# EAGLE board LEDCube_Par (EAGLE 5.09)
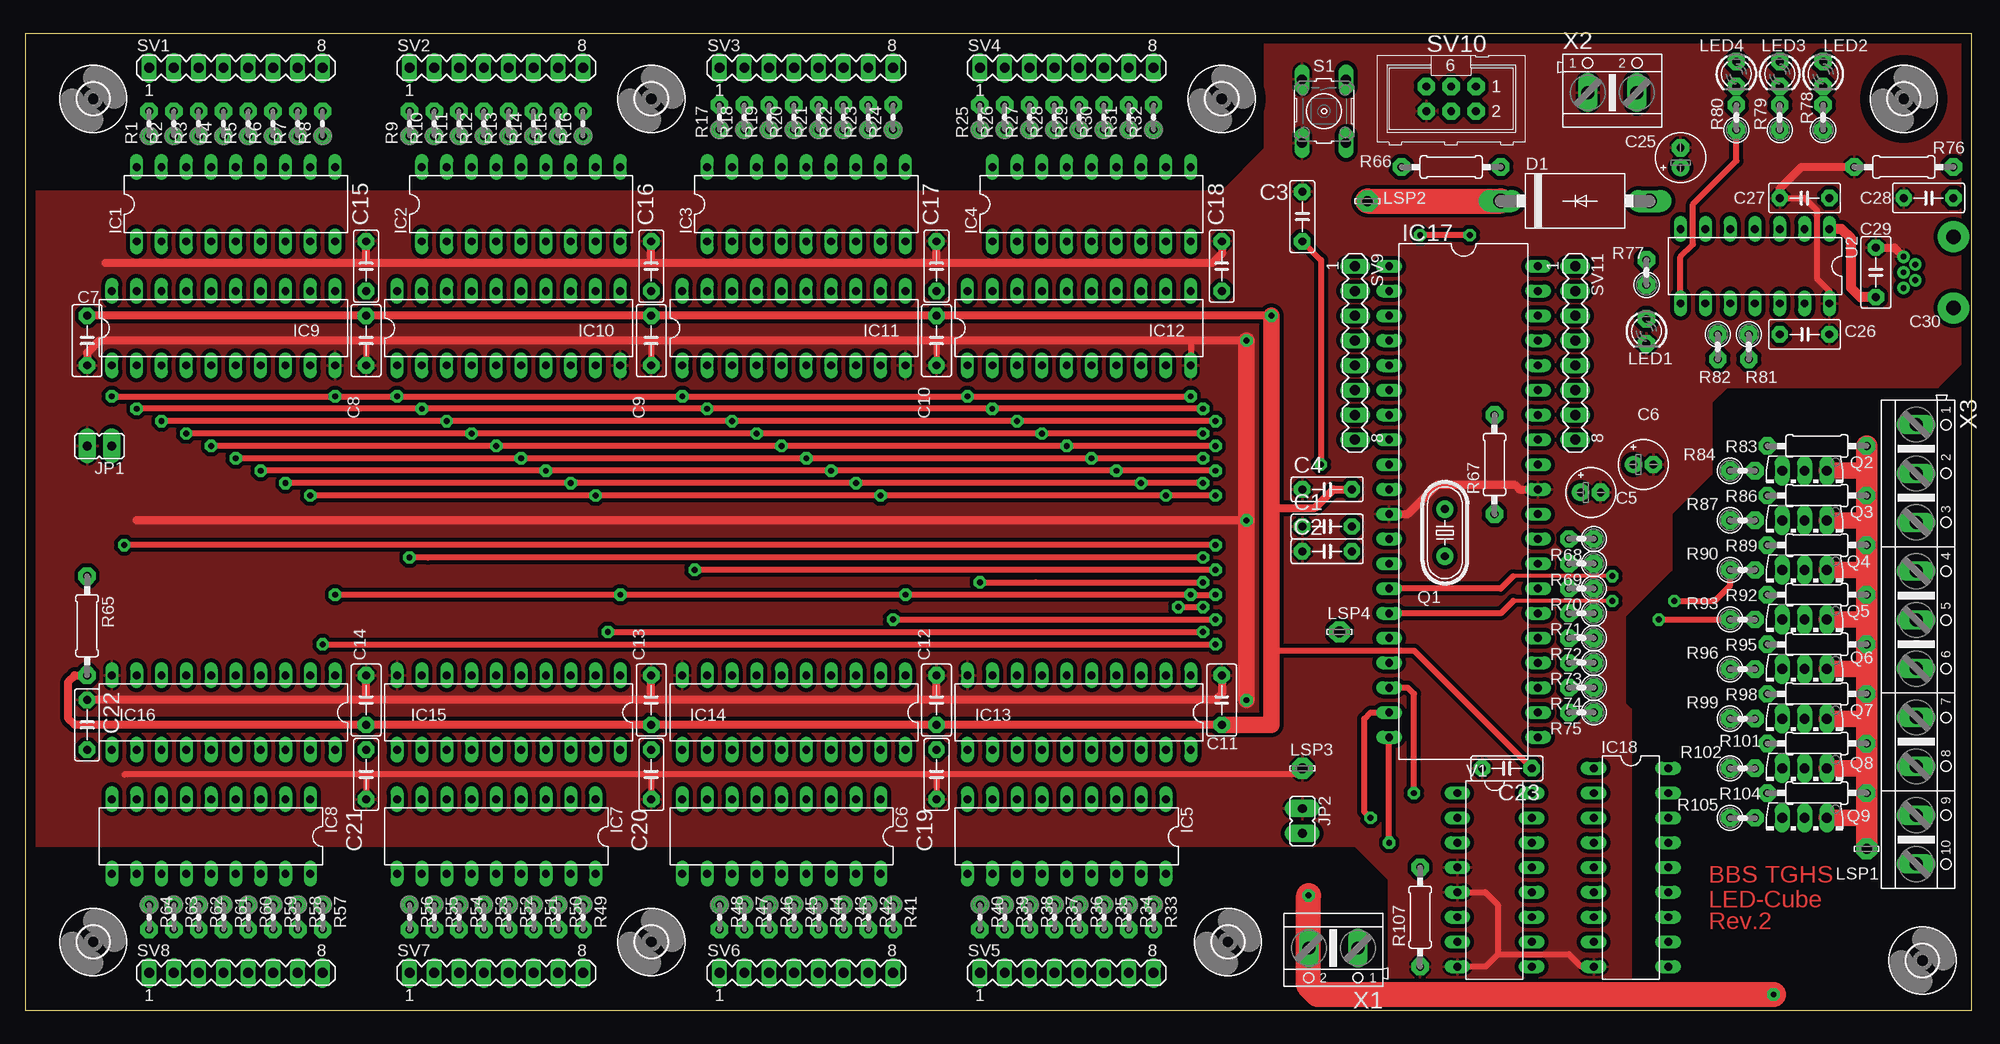
[diagram p1: board, top side]
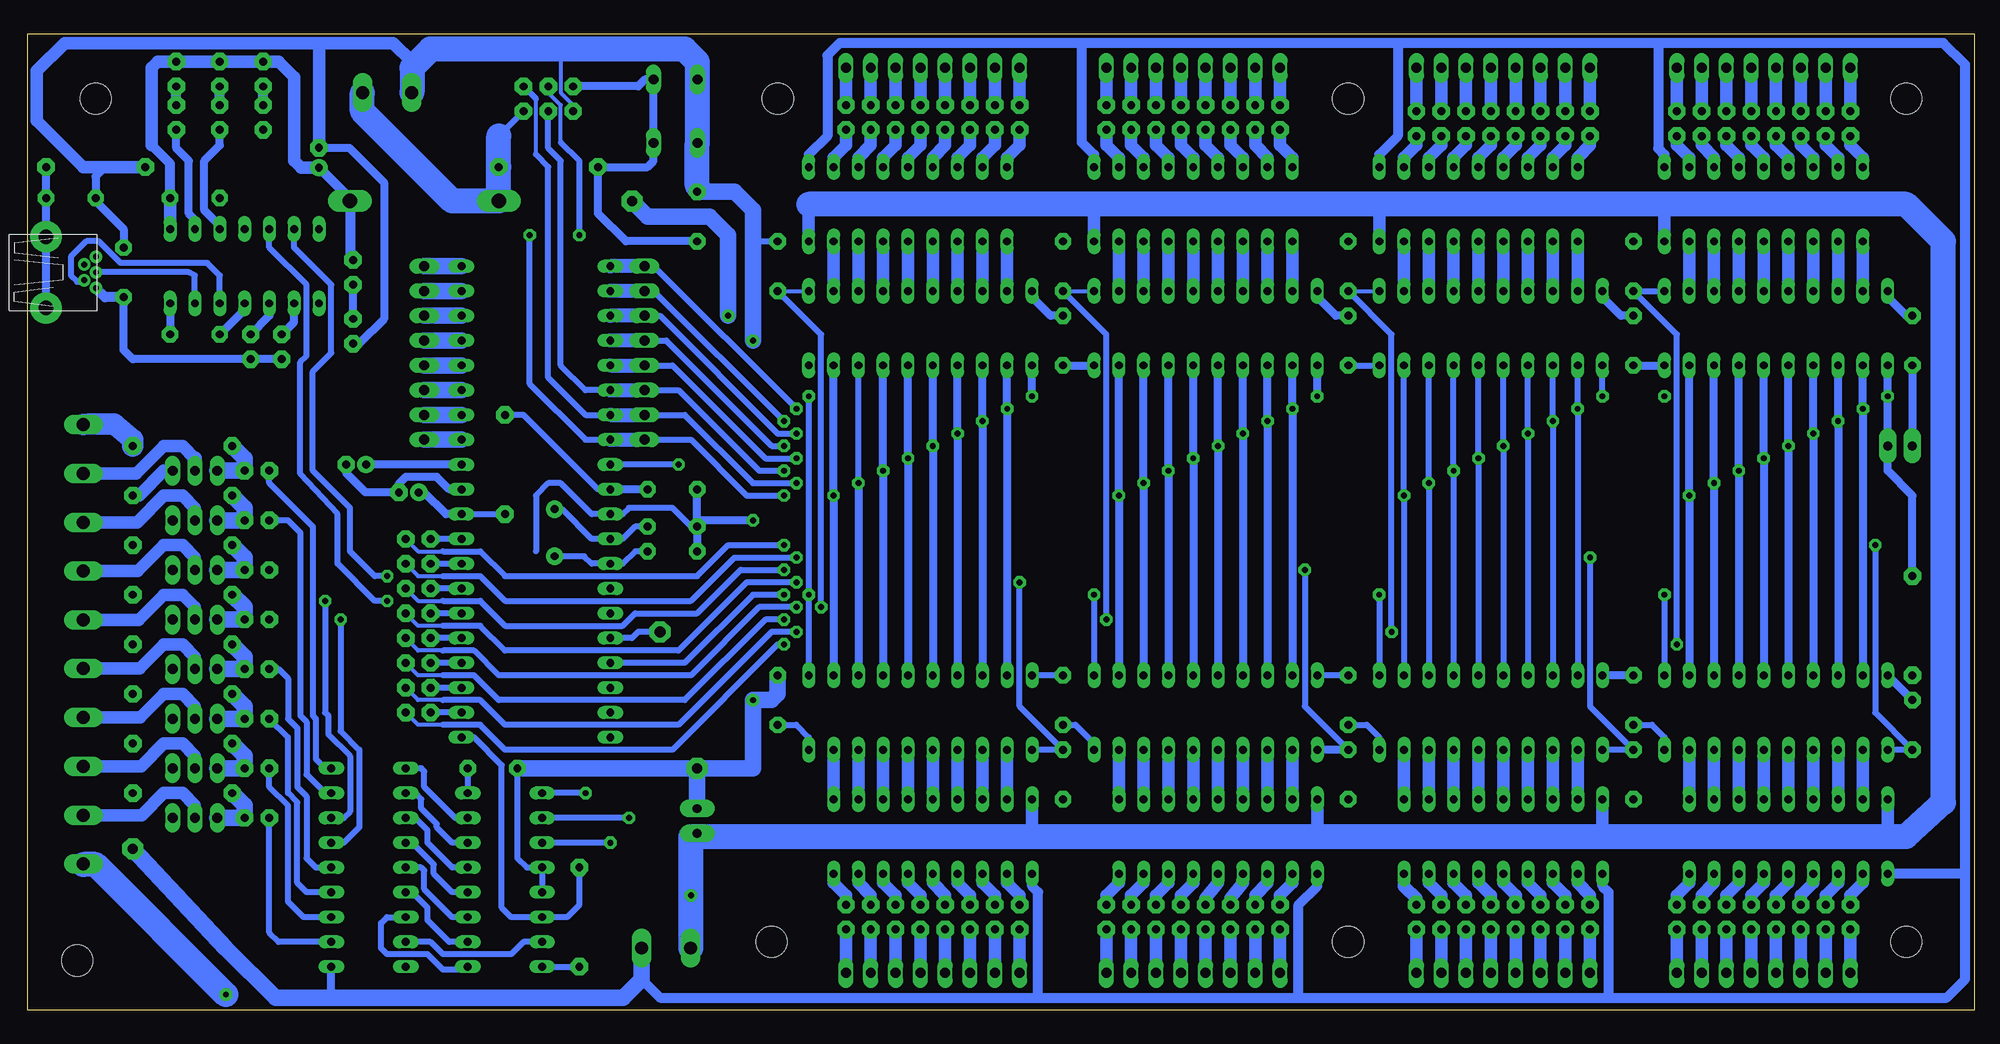
[diagram p2: board, bottom side, seen from below]

Size 199.37 x 100 mm. Coordinates in mm from the lower left corner, seen from the top.
Outline: 0,0 199.37,0 199.37,100 0,100 0,0
Copper layers (1*16): Top 0.035mm / dielectric 1.5mm / Bottom 0.035mm
Design rules "default": minimum track width 10mil, minimum drill 24mil, track to track 8mil, track to pad 8mil, pad to pad 8mil, via to via 8mil, smd to smd 8mil, copper to edge 40mil, drill to drill 8mil, minimum pad ring 10mil, minimum via ring 8mil, stop-mask expansion 4mil, vias tented up to drill 0mil, thermal gap 10mil

## Footprints (pad centres in the part's own frame; a part is rotated, then mirrored left to right if it is on the bottom)
C050-025X075 = drill 0.813 pad 1.676 octagon: 1 -2.54,0; 2 2.54,0
E2-5 = drill 0.813 pad 1.778 round: + -1.016,0 | drill 0.813 pad 1.778 octagon: - 1.016,0
C050-030X075 = drill 0.813 pad 1.676 octagon: 1 -2.54,0; 2 2.54,0
USB-MB-H-SHIELD = drill 0.6 pad 1.27 round: D+ 2.56,0; D- 1.36,0.8; GND 2.56,-1.6; ID 1.36,-0.8; VBUS 2.56,1.6 | drill 1.5 pad 3.2 round: P$6 -2.54,-3.65; P$7 -2.54,3.65
DO201-15 = drill 1.499 long: A 7.62,0; C -7.62,0
3,2 = hole 3.2: 0,0
DIL18 = drill 0.813 long: 1 -10.16,-3.81; 2 -7.62,-3.81; 3 -5.08,-3.81; 4 -2.54,-3.81; 5 0,-3.81; 6 2.54,-3.81; 7 5.08,-3.81; 8 7.62,-3.81; 9 10.16,-3.81; 10 10.16,3.81; 11 7.62,3.81; 12 5.08,3.81; 13 2.54,3.81; 14 0,3.81; 15 -2.54,3.81; 16 -5.08,3.81; 17 -7.62,3.81; 18 -10.16,3.81
DIL20 = drill 0.813 long: 1 -11.43,-3.81; 2 -8.89,-3.81; 3 -6.35,-3.81; 4 -3.81,-3.81; 5 -1.27,-3.81; 6 1.27,-3.81; 7 3.81,-3.81; 8 6.35,-3.81; 9 8.89,-3.81; 10 11.43,-3.81; 11 11.43,3.81; 12 8.89,3.81; 13 6.35,3.81; 14 3.81,3.81; 15 1.27,3.81; 16 -1.27,3.81; 17 -3.81,3.81; 18 -6.35,3.81; 19 -8.89,3.81; 20 -11.43,3.81
DIL40 = drill 0.813 long: 1 -24.13,-7.62; 2 -21.59,-7.62; 3 -19.05,-7.62; 4 -16.51,-7.62; 5 -13.97,-7.62; 6 -11.43,-7.62; 7 -8.89,-7.62; 8 -6.35,-7.62; 9 -3.81,-7.62; 10 -1.27,-7.62; 11 1.27,-7.62; 12 3.81,-7.62; 13 6.35,-7.62; 14 8.89,-7.62; 15 11.43,-7.62; 16 13.97,-7.62; 17 16.51,-7.62; 18 19.05,-7.62; 19 21.59,-7.62; 20 24.13,-7.62; 21 24.13,7.62; 22 21.59,7.62; 23 19.05,7.62; 24 16.51,7.62; 25 13.97,7.62; 26 11.43,7.62; 27 8.89,7.62; 28 6.35,7.62; 29 3.81,7.62; 30 1.27,7.62; 31 -1.27,7.62; 32 -3.81,7.62; 33 -6.35,7.62; 34 -8.89,7.62; 35 -11.43,7.62; 36 -13.97,7.62; 37 -16.51,7.62; 38 -19.05,7.62; 39 -21.59,7.62; 40 -24.13,7.62
JP1 = drill 0.914 pad 1.778 long: 1 0,-1.27; 2 0,1.27
LED3MM = drill 0.8 pad 1.778 octagon: A -1.27,0; K 1.27,0
LSP10 = drill 1.016 pad 2.159 octagon: MP 0,0
LSP11 = drill 1.118 pad 2.159 octagon: MP 0,0
HC49U-V = drill 0.8 pad 1.778 round: 1 -2.413,0 | drill 0.813 pad 1.778 round: 2 2.413,0
TO126AV = drill 1.016 long: B 2.286,-1.27; C 0,-1.27; E -2.286,-1.27
0204V = drill 0.813 pad 1.778 octagon: 1 -1.27,0; 2 1.27,0
0207/10 = drill 0.813 pad 1.778 octagon: 1 -5.08,0; 2 5.08,0
0207/2V = drill 0.813 pad 1.778 octagon: 1 -1.27,0; 2 1.27,0
B3F-10XX = drill 1.016 long: 1 -3.251,2.261; 2 3.251,2.261; 3 -3.251,-2.261; 4 3.251,-2.261
MA08-1 = drill 1.016 long: 1 -8.89,0; 2 -6.35,0; 3 -3.81,0; 4 -1.27,0; 5 1.27,0; 6 3.81,0; 7 6.35,0; 8 8.89,0
ML6 = drill 0.8 pad 1.778 octagon: 1 -2.54,-1.27; 2 -2.54,1.27; 3 0,-1.27; 4 0,1.27; 5 2.54,-1.27; 6 2.54,1.27
DIL14 = drill 0.813 long: 1 -7.62,-3.81; 2 -5.08,-3.81; 3 -2.54,-3.81; 4 0,-3.81; 5 2.54,-3.81; 6 5.08,-3.81; 7 7.62,-3.81; 8 7.62,3.81; 9 5.08,3.81; 10 2.54,3.81; 11 0,3.81; 12 -2.54,3.81; 13 -5.08,3.81; 14 -7.62,3.81
DIL16 = drill 0.813 long: 1 -8.89,-3.81; 2 -6.35,-3.81; 3 -3.81,-3.81; 4 -1.27,-3.81; 5 1.27,-3.81; 6 3.81,-3.81; 7 6.35,-3.81; 8 8.89,-3.81; 9 8.89,3.81; 10 6.35,3.81; 11 3.81,3.81; 12 1.27,3.81; 13 -1.27,3.81; 14 -3.81,3.81; 15 -6.35,3.81; 16 -8.89,3.81
AK500/2 = drill 1.321 long: 1 -2.515,0; 2 2.515,0
AK500/10 = drill 1.321 long: 1 -22.504,0; 2 -17.501,0; 3 -12.497,0; 4 -7.493,0; 5 -2.489,0; 6 2.489,0; 7 7.493,0; 8 12.497,0; 9 17.501,0; 10 22.504,0

## Placement (x,y rotation side)
C1  22p  [C050-025X075]  133.35,49.53 0 top
C2  22p  [C050-025X075]  133.35,46.99 0 top
C3  100n  [C050-025X075]  130.81,81.28 270 top
C4  100n  [C050-025X075]  133.35,53.34 0 top
C5  4u7  [E2-5]  160.34,53.02 0 top
C6  4u7  [E2-5]  165.74,55.88 0 top
C7  100n  [C050-030X075]  6.35,68.58 270 top
C8  100n  [C050-030X075]  34.92,68.58 270 top
C9  100n  [C050-030X075]  64.14,68.58 270 top
C10  100n  [C050-030X075]  93.34,68.58 270 top
C11  100n  [C050-030X075]  122.56,31.75 90 top
C12  100n  [C050-030X075]  93.34,31.75 90 top
C13  100n  [C050-030X075]  64.14,31.75 90 top
C14  100n  [C050-030X075]  34.92,31.75 90 top
C15  470p  [C050-025X075]  34.92,76.2 270 top
C16  470p  [C050-025X075]  64.14,76.2 270 top
C17  470p  [C050-025X075]  93.34,76.2 270 top
C18  470p  [C050-025X075]  122.56,76.2 270 top
C19  470p  [C050-025X075]  93.34,24.13 90 top
C20  470p  [C050-025X075]  64.14,24.13 90 top
C21  470p  [C050-025X075]  34.92,24.13 90 top
C22  470p  [C050-025X075]  6.35,29.21 270 top
C23  100n  [C050-025X075]  151.76,24.77 180 top
C25  47µ/25V  [E2-5]  169.54,87.31 90 top
C26  330n  [C050-030X075]  182.25,69.22 0 top
C27  100n  [C050-030X075]  182.25,83.19 180 top
C28  10n  [C050-030X075]  194.94,83.19 0 top
C29  100n  [C050-030X075]  189.55,75.56 270 top
C30  USB_SHIELED  [USB-MB-H-SHIELD]  194.94,75.56 180 top
D1  SB320  [DO201-15]  158.75,82.87 0 top
H1  MOUNT-HOLE3.2  [3,2]  194.31,5.08 0 top
H2  MOUNT-HOLE3.2  [3,2]  192.41,93.35 0 top
H3  MOUNT-HOLE3.2  [3,2]  6.99,93.35 0 top
H4  MOUNT-HOLE3.2  [3,2]  6.99,6.98 0 top
H5  MOUNT-HOLE3.2  [3,2]  122.56,93.35 0 top
H6  MOUNT-HOLE3.2  [3,2]  64.14,6.98 0 top
H7  MOUNT-HOLE3.2  [3,2]  123.19,6.98 0 top
H8  MOUNT-HOLE3.2  [3,2]  64.14,93.35 0 top
IC1  UDN2803  [DIL18]  21.59,82.55 0 top
IC2  UDN2803  [DIL18]  50.8,82.55 0 top
IC3  UDN2803  [DIL18]  80.01,82.55 0 top
IC4  UDN2803  [DIL18]  109.22,82.55 0 top
IC5  UDN2803  [DIL18]  106.68,17.78 180 top
IC6  UDN2803  [DIL18]  77.47,17.78 180 top
IC7  UDN2803  [DIL18]  48.26,17.78 180 top
IC8  UDN2803  [DIL18]  19.05,17.78 180 top
IC9  74AC573N  [DIL20]  20.32,69.85 0 top
IC10  74AC573N  [DIL20]  49.53,69.85 0 top
IC11  74AC573N  [DIL20]  78.74,69.85 0 top
IC12  74AC573N  [DIL20]  107.95,69.85 0 top
IC13  74AC573N  [DIL20]  107.95,30.48 180 top
IC14  74AC573N  [DIL20]  78.74,30.48 180 top
IC15  74AC573N  [DIL20]  49.53,30.48 180 top
IC16  74AC573N  [DIL20]  20.32,30.48 180 top
IC17  MEGA32-P  [DIL40]  147.32,52.07 270 top
IC18  [DIL18]  164.47,14.61 270 top
JP1  [JP1]  7.62,57.78 90 top
JP2  [JP1]  130.81,19.37 180 top
LED1  [LED3MM]  166.05,69.53 270 top
LED2  [LED3MM]  184.15,95.89 270 top
LED3  [LED3MM]  179.71,95.89 270 top
LED4  [LED3MM]  175.26,95.89 270 top
LSP1  LSP10  [LSP10]  188.59,16.51 0 top
LSP2  LSP10  [LSP10]  137.48,82.87 0 top
LSP3  LSP10  [LSP10]  130.81,24.77 0 top
LSP4  LSP11  [LSP11]  134.62,38.73 0 top
Q1  16MHz  [HC49U-V]  145.41,48.89 90 top
Q2  BD140  [TO126AV]  182.25,53.98 180 top
Q3  BD140  [TO126AV]  182.25,48.89 180 top
Q4  BD140  [TO126AV]  182.25,43.81 180 top
Q5  BD140  [TO126AV]  182.25,38.73 180 top
Q6  BD140  [TO126AV]  182.25,33.66 180 top
Q7  BD140  [TO126AV]  182.25,28.58 180 top
Q8  BD140  [TO126AV]  182.25,23.5 180 top
Q9  BD140  [TO126AV]  182.25,18.42 180 top
R1  100R  [0204V]  12.7,90.8 90 top
R2  100R  [0204V]  15.24,90.8 90 top
R3  100R  [0204V]  17.78,90.8 90 top
R4  100R  [0204V]  20.32,90.8 90 top
R5  100R  [0204V]  22.86,90.8 90 top
R6  100R  [0204V]  25.4,90.8 90 top
R7  100R  [0204V]  27.94,90.8 90 top
R8  100R  [0204V]  30.48,90.8 90 top
R9  100R  [0204V]  39.37,90.8 90 top
R10  100R  [0204V]  41.91,90.8 90 top
R11  100R  [0204V]  44.45,90.8 90 top
R12  100R  [0204V]  46.99,90.8 90 top
R13  100R  [0204V]  49.53,90.8 90 top
R14  100R  [0204V]  52.07,90.8 90 top
R15  100R  [0204V]  54.61,90.8 90 top
R16  100R  [0204V]  57.15,90.8 90 top
R17  100R  [0204V]  71.12,91.44 90 top
R18  100R  [0204V]  73.66,91.44 90 top
R19  100R  [0204V]  76.2,91.44 90 top
R20  100R  [0204V]  78.74,91.44 90 top
R21  100R  [0204V]  81.28,91.44 90 top
R22  100R  [0204V]  83.82,91.44 90 top
R23  100R  [0204V]  86.36,91.44 90 top
R24  100R  [0204V]  88.9,91.44 90 top
R25  100R  [0204V]  97.79,91.44 90 top
R26  100R  [0204V]  100.33,91.44 90 top
R27  100R  [0204V]  102.87,91.44 90 top
R28  100R  [0204V]  105.41,91.44 90 top
R29  100R  [0204V]  107.95,91.44 90 top
R30  100R  [0204V]  110.49,91.44 90 top
R31  100R  [0204V]  113.03,91.44 90 top
R32  100R  [0204V]  115.57,91.44 90 top
R33  100R  [0204V]  115.57,9.53 270 top
R34  100R  [0204V]  113.03,9.53 270 top
R35  100R  [0204V]  110.49,9.53 270 top
R36  100R  [0204V]  107.95,9.53 270 top
R37  100R  [0204V]  105.41,9.53 270 top
R38  100R  [0204V]  102.87,9.53 270 top
R39  100R  [0204V]  100.33,9.53 270 top
R40  100R  [0204V]  97.79,9.53 270 top
R41  100R  [0204V]  88.9,9.53 270 top
R42  100R  [0204V]  86.36,9.53 270 top
R43  100R  [0204V]  83.82,9.53 270 top
R44  100R  [0204V]  81.28,9.53 270 top
R45  100R  [0204V]  78.74,9.53 270 top
R46  100R  [0204V]  76.2,9.53 270 top
R47  100R  [0204V]  73.66,9.53 270 top
R48  100R  [0204V]  71.12,9.53 270 top
R49  100R  [0204V]  57.15,9.53 270 top
R50  100R  [0204V]  54.61,9.53 270 top
R51  100R  [0204V]  52.07,9.53 270 top
R52  100R  [0204V]  49.53,9.53 270 top
R53  100R  [0204V]  46.99,9.53 270 top
R54  100R  [0204V]  44.45,9.53 270 top
R55  100R  [0204V]  41.91,9.53 270 top
R56  100R  [0204V]  39.37,9.53 270 top
R57  100R  [0204V]  30.48,9.53 270 top
R58  100R  [0204V]  27.94,9.53 270 top
R59  100R  [0204V]  25.4,9.53 270 top
R60  100R  [0204V]  22.86,9.53 270 top
R61  100R  [0204V]  20.32,9.53 270 top
R62  100R  [0204V]  17.78,9.53 270 top
R63  100R  [0204V]  15.24,9.53 270 top
R64  100R  [0204V]  12.7,9.53 270 top
R65  10k  [0207/10]  6.35,39.37 270 top
R66  100k  [0207/10]  146.05,86.36 0 top
R67  10R  [0207/10]  150.5,55.88 90 top
R68  100R  [0207/2V]  159.38,48.26 180 top
R69  100R  [0207/2V]  159.38,45.72 180 top
R70  100R  [0207/2V]  159.38,43.18 180 top
R71  100R  [0207/2V]  159.38,40.64 180 top
R72  100R  [0207/2V]  159.38,38.1 180 top
R73  100R  [0207/2V]  159.38,35.56 180 top
R74  100R  [0207/2V]  159.38,33.02 180 top
R75  100R  [0207/2V]  159.38,30.48 180 top
R76  10M  [0207/10]  192.41,86.36 180 top
R77  1k8  [0207/2V]  166.05,75.56 90 top
R78  1k8  [0207/2V]  184.15,91.44 90 top
R79  1k8  [0207/2V]  179.71,91.44 90 top
R80  1k8  [0207/2V]  175.26,91.44 90 top
R81  10k  [0207/2V]  176.53,67.95 270 top
R82  10k  [0207/2V]  173.35,67.95 270 top
R83  4k7  [0207/10]  183.51,57.78 0 top
R84  2k2  [0207/2V]  175.9,55.25 0 top
R86  4k7  [0207/10]  183.51,52.7 0 top
R87  2k2  [0207/2V]  175.9,50.17 0 top
R89  4k7  [0207/10]  183.51,47.62 0 top
R90  2k2  [0207/2V]  175.9,45.09 0 top
R92  4k7  [0207/10]  183.51,42.55 0 top
R93  2k2  [0207/2V]  175.9,40.01 0 top
R95  4k7  [0207/10]  183.51,37.47 0 top
R96  2k2  [0207/2V]  175.9,34.92 0 top
R98  4k7  [0207/10]  183.51,32.39 0 top
R99  2k2  [0207/2V]  175.9,29.84 0 top
R101  4k7  [0207/10]  183.51,27.31 0 top
R102  2k2  [0207/2V]  175.9,24.77 0 top
R104  4k7  [0207/10]  183.51,22.23 0 top
R105  2k2  [0207/2V]  175.9,19.69 0 top
R107  10k  [0207/10]  142.88,9.53 90 top
S1  [B3F-10XX]  133.03,92.08 270 top
SV1  [MA08-1]  21.59,96.52 0 top
SV2  [MA08-1]  48.26,96.52 0 top
SV3  [MA08-1]  80.01,96.52 0 top
SV4  [MA08-1]  106.68,96.52 0 top
SV5  [MA08-1]  106.68,3.81 0 top
SV6  [MA08-1]  80.01,3.81 0 top
SV7  [MA08-1]  48.26,3.81 0 top
SV8  [MA08-1]  21.59,3.81 0 top
SV9  [MA08-1]  136.21,67.31 270 top
SV10  [ML6]  146.05,93.35 180 top
SV11  [MA08-1]  158.75,67.31 270 top
U2  MCP2221  [DIL14]  177.16,76.2 180 top
V1  74238N  [DIL16]  150.5,13.34 270 top
X1  [AK500/2]  133.99,6.35 180 top
X2  [AK500/2]  162.56,93.98 0 top
X3  [AK500/10]  193.68,37.47 270 top

## Tracks (layer width: path | path; a pad name or v marks a point on that pad's centre or on a via)
+5V  (via drill 0.6 pad 1.27)
  Top 0.61: C23.1 142.24,36.83 127.64,36.83
  Top 0.813: C7.1 C8.1 C9.1 C10.1 v127.64,71.12 | C11.1 C12.1 C13.1 C14.1 5.08,29.21 4.45,29.84 4.45,33.66 5.08,34.29 R65.2 | C4.2 133.99,53.34 132.08,51.44 127.64,51.44
  Top 1.676: v127.64,71.12 127.64,51.44 127.64,36.83 127.64,29.21 C11.1
  Top 2.54: LSP2.MP D1.C
  Bottom 0.61: IC14.20 90.17,27.31 92.08,29.21 C12.1 | IC15.20 60.96,27.94 62.23,29.21 C13.1 | IC16.20 31.75,27.94 33.02,29.21 C14.1 | IC13.20 119.38,27.94 120.65,29.21 C11.1 | 151.13,89.54 SV10.2 | 165.1,93.95 X2.2 | C23.1 V1.16 | IC17.10 140.97,53.34 148.59,60.96 R67.2
  Bottom 0.813: IC9.20 8.89,73.03 6.99,71.12 C7.1 | IC10.20 38.1,73.03 36.2,71.12 C8.1 | IC11.20 67.31,73.03 65.41,71.12 C9.1 | IC12.20 96.52,73.03 94.61,71.12 C10.1 | C4.2 IC17.10
  Bottom 1.676: v127.64,71.12 127.64,79.38 129.54,81.28 132.72,81.28 135.89,81.28 LSP2.MP
  Bottom 2.54: 151.13,89.54 R66.2 D1.C 155.89,82.87 165.1,92.08 165.1,93.95
+12V
  Top 1.676: 188.59,55.25 Q2.E | 188.59,50.17 Q3.E | 188.59,45.09 Q4.E | 188.59,40.01 Q5.E | 188.59,34.92 Q6.E | 188.59,29.84 Q7.E | 188.59,24.77 Q8.E | 188.59,19.69 Q9.E
  Top 2.184: LSP1.MP 188.59,19.69 R104.2 188.59,24.77 R101.2 188.59,29.84 R98.2 188.59,34.92 R95.2 188.59,40.01 R92.2 188.59,45.09 R89.2 188.59,50.17 188.59,55.25 R83.2
  Bottom 0.813: 168.28,1.27 IC18.10
  Bottom 1.016: IC4.10 119.38,87.63 117.47,89.54 117.47,97.79 116.2,99.06 91.44,99.06 | 59.05,99.06 91.44,99.06 | 32.38,99.06 59.05,99.06 | 32.38,99.06 3.17,99.06 0.95,96.84 0.95,13.97 | IC3.10 90.17,87.63 91.44,88.9 91.44,99.06 | IC2.10 60.96,87.63 59.05,89.54 59.05,99.06 | IC1.10 31.75,87.63 32.38,88.27 32.38,99.06 | 0.95,13.97 0.95,3.18 2.86,1.27 37.47,1.27 | 69.22,1.27 37.47,1.27 | 95.89,1.27 69.22,1.27 | 95.89,1.27 134.62,1.27 136.5,3.15 | 0.95,13.97 IC8.10 | IC7.10 38.1,12.7 37.47,12.07 37.47,1.27 | IC6.10 67.31,12.7 69.22,10.8 69.22,1.27 | IC5.10 96.52,12.7 95.89,12.07 95.89,1.27
  Bottom 1.27: Q2.E 185.42,55.25 187.96,52.7 R86.2
  Bottom 1.676: X1.1 136.5,3.15 138.38,1.27 168.28,1.27 173.99,1.27 179.07,6.35 LSP1.MP
  Bottom 2.184: X3.1 193.08,60.01 190.5,60.01 188.59,58.42 R83.2
/OE  (via drill 0.6 pad 1.27)
  Top 0.61: v8.89,62.87 v31.75,62.87 v38.1,62.87 v67.31,62.87 v96.52,62.87 v119.38,62.87 | v121.92,42.55 v119.38,42.55 v90.17,42.55 v60.96,42.55 v31.75,42.55
  Bottom 0.61: v38.1,62.87 IC10.1 | IC17.17 132.08,35.56 125.09,42.55 v121.92,42.55 | IC13.1 v119.38,42.55 v119.38,62.87 | v90.17,42.55 IC14.1 | v60.96,42.55 IC15.1 | v31.75,42.55 IC16.1
  Bottom 0.813: IC9.1 v8.89,62.87 JP1.1 8.89,55.25 6.35,52.7 R65.1 | v96.52,62.87 IC12.1 | v67.31,62.87 IC11.1
CL0  (via drill 0.6 pad 1.27)
  Top 0.61: v30.48,37.47 v121.92,37.47
  Bottom 0.406: R75.1 159.38,29.21 156.84,29.21
  Bottom 0.61: IC9.11 C15.2 30.48,69.22 v30.48,37.47 | 156.84,29.21 153.03,29.21 150.5,26.67 133.35,26.67 122.56,37.47 v121.92,37.47
CL1  (via drill 0.6 pad 1.27)
  Top 0.61: v59.69,38.73 v120.65,38.73
  Bottom 0.406: C16.2 IC10.11 | R74.1 159.38,31.75 156.84,31.75
  Bottom 0.61: C16.2 59.69,69.22 v59.69,38.73 | 156.84,31.75 153.03,31.75 150.5,29.21 132.72,29.21 123.19,38.73 v120.65,38.73
CL2  (via drill 0.6 pad 1.27)
  Top 0.61: v88.9,40.01 v121.92,40.01
  Bottom 0.406: C17.2 IC11.11 | R73.1 159.38,34.29 156.84,34.29
  Bottom 0.61: C17.2 88.9,69.22 v88.9,40.01 | 156.84,34.29 153.67,34.29 151.13,31.75 132.08,31.75 123.83,40.01 v121.92,40.01
CL3  (via drill 0.6 pad 1.27)
  Top 0.61: v118.11,41.28 v120.65,41.28
  Bottom 0.406: C18.2 IC12.11 | R72.1 159.38,36.83 156.84,36.83
  Bottom 0.61: C18.2 118.11,69.22 v118.11,41.28 | 156.84,36.83 153.67,36.83 151.13,34.29 131.44,34.29 124.46,41.28 v120.65,41.28
CL4  (via drill 0.6 pad 1.27)
  Top 0.61: v120.65,43.81 103.5,43.81 v97.79,43.81
  Bottom 0.406: R71.1 159.38,39.37 156.84,39.37
  Bottom 0.61: 156.84,39.37 153.03,39.37 150.5,36.83 132.72,36.83 125.73,43.81 v120.65,43.81 | IC13.11 C19.2 97.79,31.12 v97.79,43.81
CL5  (via drill 0.6 pad 1.27)
  Top 0.61: v121.92,45.09 v68.58,45.09
  Bottom 0.406: R70.1 159.38,41.91 156.84,41.91
  Bottom 0.61: 156.84,41.91 153.03,41.91 150.5,39.37 138.43,39.37 137.16,40.64 130.81,40.64 126.36,45.09 v121.92,45.09 | C20.2 68.58,31.12 v68.58,45.09
  Bottom 0.813: C20.2 IC14.11
CL6  (via drill 0.6 pad 1.27)
  Top 0.61: v120.65,46.36 41.27,46.36 v39.37,46.36
  Bottom 0.406: R69.1 159.38,44.45 156.84,44.45
  Bottom 0.61: 156.84,44.45 153.03,44.45 150.5,41.91 131.44,41.91 127,46.36 v120.65,46.36 | IC15.11 C21.2 39.37,31.12 v39.37,46.36
CL7  (via drill 0.6 pad 1.27)
  Top 0.61: v121.92,47.62 v10.16,47.62
  Bottom 0.406: R68.1 159.38,46.99 156.84,46.99
  Bottom 0.61: 156.84,46.99 153.03,46.99 150.5,44.45 130.81,44.45 127.64,47.62 v121.92,47.62 | IC16.11 C22.2 10.16,30.48 v10.16,47.62
D0  (via drill 0.6 pad 1.27)
  Top 0.61: v120.65,61.59 v99.06,61.59 v69.85,61.59 v40.64,61.59 v11.43,61.59
  Bottom 0.61: v120.65,61.59 135.25,76.2 SV9.1 | IC10.2 v40.64,61.59 IC15.9
  Bottom 0.813: IC12.2 v99.06,61.59 IC13.9 | IC16.9 v11.43,61.59 IC9.2 | IC11.2 v69.85,61.59 IC14.9
  Bottom 1.422: SV9.1 IC17.1
D1  (via drill 0.6 pad 1.27)
  Top 0.61: v121.92,60.33 v101.6,60.33 v72.39,60.33 v43.18,60.33 v13.97,60.33
  Bottom 0.61: v121.92,60.33 135.25,73.66 SV9.2 | IC10.3 v43.18,60.33 IC15.8
  Bottom 0.813: IC16.8 v13.97,60.33 IC9.3 | IC12.3 v101.6,60.33 IC13.8 | IC11.3 v72.39,60.33 IC14.8
  Bottom 1.422: SV9.2 IC17.2
D2  (via drill 0.6 pad 1.27)
  Top 0.61: v120.65,59.06 v104.14,59.06 v74.93,59.06 v45.72,59.06 v16.51,59.06
  Bottom 0.61: v120.65,59.06 122.56,59.06 134.62,71.12 SV9.3 | IC15.7 v45.72,59.06 IC10.4
  Bottom 0.813: IC16.7 v16.51,59.06 IC9.4 | IC12.4 v104.14,59.06 IC13.7 | IC11.4 v74.93,59.06 IC14.7
  Bottom 1.422: SV9.3 IC17.3
D3  (via drill 0.6 pad 1.27)
  Top 0.61: v121.92,57.78 v106.68,57.78 v77.47,57.78 v48.26,57.78 v19.05,57.78
  Bottom 0.61: v121.92,57.78 123.19,57.78 133.99,68.58 SV9.4 | IC10.5 v48.26,57.78 IC15.6
  Bottom 0.813: IC16.6 v19.05,57.78 IC9.5 | IC12.5 v106.68,57.78 IC13.6 | IC11.5 v77.47,57.78 IC14.6
  Bottom 1.422: SV9.4 IC17.4
D4  (via drill 0.6 pad 1.27)
  Top 0.61: v120.65,56.52 v109.22,56.52 v80.01,56.52 v50.8,56.52 v21.59,56.52
  Bottom 0.61: v120.65,56.52 123.83,56.52 133.35,66.04 SV9.5 | IC15.5 v50.8,56.52 IC10.6
  Bottom 0.813: IC16.5 v21.59,56.52 IC9.6 | IC12.6 v109.22,56.52 IC13.5 | IC11.6 v80.01,56.52 IC14.5
  Bottom 1.422: IC17.5 SV9.5
D5  (via drill 0.6 pad 1.27)
  Top 0.61: v121.92,55.25 v111.76,55.25 v82.55,55.25 v53.34,55.25 v24.13,55.25
  Bottom 0.61: v121.92,55.25 124.46,55.25 132.72,63.5 SV9.6 | IC10.7 v53.34,55.25 IC15.4 | IC17.6 142.24,63.5 144.78,66.04 144.78,86.99 146.05,88.27 SV10.4
  Bottom 0.813: IC16.4 v24.13,55.25 IC9.7 | IC12.7 v111.76,55.25 IC13.4 | IC11.7 v82.55,55.25 IC14.4
  Bottom 1.422: IC17.6 SV9.6
D6  (via drill 0.6 pad 1.27)
  Top 0.61: v120.65,53.98 v114.3,53.98 v85.09,53.98 v55.88,53.98 v26.67,53.98
  Bottom 0.406: 147.32,87.63 147.32,93.35
  Bottom 0.61: v120.65,53.98 125.09,53.98 132.08,60.96 SV9.7 | v114.3,53.98 IC12.8 | IC10.8 v55.88,53.98 IC15.3 | IC17.7 142.24,60.96 146.05,64.77 146.05,86.36 147.32,87.63 | 147.32,93.35 SV10.1
  Bottom 0.813: IC16.3 v26.67,53.98 IC9.8 | IC11.8 v85.09,53.98 IC14.3 | v114.3,53.98 IC13.3
  Bottom 1.422: IC17.7 SV9.7
D7  (via drill 0.6 pad 1.27)
  Top 0.61: v121.92,52.7 v116.84,52.7 v87.63,52.7 v58.42,52.7 v29.21,52.7 | v147.96,79.38 v142.88,79.38
  Bottom 0.406: 144.78,88.9 144.78,92.71 146.05,93.98 SV10.3
  Bottom 0.61: v121.92,52.7 125.73,52.7 131.44,58.42 SV9.8 | IC15.2 v58.42,52.7 IC10.9 | IC17.8 142.24,58.42 147.96,64.14 v147.96,79.38 | 144.78,88.9 142.88,86.99 v142.88,79.38
  Bottom 0.813: IC16.2 v29.21,52.7 IC9.9 | IC12.9 v116.84,52.7 IC13.2 | IC11.9 v87.63,52.7 IC14.2
  Bottom 1.422: IC17.8 SV9.8
E0  (via drill 0.6 pad 1.27)
  Top 0.61: v142.24,22.23 142.24,32.39 141.6,33.02 IC17.18
  Bottom 0.61: v142.24,22.23 V1.1
E1  (via drill 0.6 pad 1.27)
  Top 0.61: v137.79,19.69 137.16,20.32 137.16,29.84 137.79,30.48 IC17.19
  Bottom 0.61: v137.79,19.69 V1.2
E2  (via drill 0.6 pad 1.27)
  Top 0.61: v139.7,17.14 IC17.20
  Bottom 0.61: v139.7,17.14 V1.3
ENABLE
  Bottom 0.61: R107.2 142.88,10.8 144.15,9.53 V1.6 149.86,9.53 150.81,10.48 150.81,25.08 153.67,27.94 IC17.21
GND  (via drill 0.6 pad 1.27)
  Top 0.61: 119.38,68.58 IC12.10 | 93.34,68.58 C10.2 | 64.14,68.58 C9.2 | 34.92,68.58 C8.2 | 34.92,24.13 C21.1 | 34.92,24.13 10.16,24.13 | 64.14,24.13 34.92,24.13 | 93.34,24.13 64.14,24.13 | 93.34,24.13 130.18,24.13 LSP3.MP | 64.14,24.13 C20.1 | 93.34,24.13 C19.1 | IC18.9 159.38,4.45 158.12,5.72 150.81,5.72 | 150.81,5.72 149.54,4.45 V1.8 | V1.5 149.54,12.07 150.81,10.8 150.81,5.72 | U2.14 184.78,73.66 183.51,74.93 183.51,81.92 182.25,83.19 C27.2
  Top 0.813: C18.1 122.56,77.47 121.6,76.52 93.34,76.52 | 34.92,76.52 8.26,76.52 | 64.14,76.52 34.92,76.52 | 93.34,76.52 64.14,76.52 | 34.92,76.52 C15.1 | 64.14,76.52 C16.1 | 93.34,76.52 C17.1 | C7.2 6.35,67.31 7.62,68.58 34.92,68.58 64.14,68.58 93.34,68.58 119.38,68.58 v125.09,68.58 | 64.14,31.75 34.92,31.75 | 93.34,31.75 64.14,31.75 | 93.34,31.75 121.92,31.75 122.56,32.39 C11.2 | 93.34,31.75 C12.2 | 64.14,31.75 C13.2 | 34.92,31.75 C14.2 | 34.92,31.75 C22.1 | v125.09,50.17 11.43,50.17 | IC17.31 153.03,53.34 152.56,53.82 144.62,53.82 141.6,50.8 IC17.11 | C30.GND 191.44,78.11 C29.1 | R76.2 181.93,86.36 179.71,84.14 C27.2
  Top 1.676: v125.09,68.58 v125.09,50.17 v125.09,31.75
  Bottom 0.305: C3.1 130.81,84.45
  Bottom 0.406: SV10.6 143.51,92.71 144.78,93.98 144.78,98.42
  Bottom 0.61: C9.2 IC10.10 | 125.09,78.74 C18.1 | C1.1 131.44,49.53 133.35,51.44 137.79,51.44 138.43,50.8 IC17.11 141.6,50.8 144.78,53.98 146.05,53.98 147.32,52.7 147.32,46.99 | C12.2 IC13.10 | C13.2 IC14.10 | V1.5 V1.4 148.27,14.61 149.22,15.56 C23.2 | V1.8 R107.1
  Bottom 0.813: C7.2 JP1.2 | C8.2 IC9.10 | C10.2 IC11.10 | C22.1 IC16.10 | C14.2 IC15.10 | 130.81,50.17 C1.1 C2.1 | 130.81,50.17 C4.1 | v125.09,50.17 130.81,50.17 | IC17.31 156.21,53.34 157.48,54.61 160.66,54.61 161.35,53.91 C5.- 164.78,53.02 166.75,54.99 C6.- | U2.14 C26.2 | R76.2 191.45,86.36 192.41,85.41 C28.1 192.41,82.87 189.55,80.01 C29.1 | LED1.K 165.42,68.26 162.88,70.8 162.88,84.77 166.43,88.33 C25.-
  Bottom 1.27: R76.2 193.68,86.36 198.44,91.12 198.44,96.2 195.58,99.06 169.54,99.06 | 169.54,99.06 161.93,99.06 160.04,97.18 X2.1 | 169.54,99.06 C25.-
  Bottom 1.676: v125.09,68.58 125.09,78.74 125.09,81.92 127,83.82 C3.1 | 160.02,94.01 X2.1 | 130.81,88.79 S1.4 | C11.2 122.56,32.39 123.19,31.75 v125.09,31.75 125.09,24.77 LSP3.MP | LSP3.MP C23.2 | LSP3.MP JP2.1
  Bottom 2.54: 160.02,94.01 160.02,96.52 158.12,98.42 144.78,98.42 132.08,98.42 130.77,97.12 S1.3 S1.4 | 130.81,84.45 130.81,88.79
  pour Top (isolate 0.406): -1.91,83.82 122.56,83.82 127,88.27 127,99.38 128.27,100.65 199.71,100.65 200.03,100.33 200.03,67.95 195.9,63.82 174.31,63.82 172.72,62.23 172.72,54.93 168.59,50.8 168.59,45.09 163.83,40.32 163.83,31.43 164.47,30.8 164.47,0 140.34,0 139.7,0.64 139.7,13.34 136.21,16.83 107.95,16.83 5.4,16.83 -0.95,16.83 -1.91,17.78
GNDA  (via drill 0.6 pad 1.27)
  Top 2.54: v179.07,1.59 132.4,1.59 131.44,2.54 v131.44,11.75
  Bottom 0.813: JP2.2 131.13,17.78 131.44,17.78
  Bottom 1.27: 119.38,82.55 IC4.9 | 90.17,82.55 IC3.9 | 60.96,82.55 IC2.9 | 31.75,82.55 IC1.9 | 96.52,17.78 IC5.9 | 8.89,17.78 IC8.9 | 38.1,17.78 IC7.9 | 67.31,17.78 IC6.9
  Bottom 1.676: X1.2 131.44,6.38 | 193.64,14.92 X3.10
  Bottom 2.54: 119.38,82.55 90.17,82.55 60.96,82.55 31.75,82.55 6.99,82.55 3.17,78.74 3.17,21.27 6.99,17.78 8.89,17.78 38.1,17.78 67.31,17.78 96.52,17.78 131.44,17.78 131.44,6.38 | 193.64,14.92 192.41,14.92 v179.07,1.59 | v131.44,11.75 131.47,11.72 X1.2
GP0
  Bottom 0.813: U2.2 182.25,80.96 182.88,81.6 182.88,86.99 184.15,88.27 R78.1
GP1
  Bottom 0.813: U2.3 179.71,80.33 181.29,81.92 181.29,86.99 179.71,88.58 R79.1
GP3
  Top 0.61: U2.8 169.54,77.15 170.81,78.42 170.81,82.55 175.26,86.99 R80.1
IN1
  Bottom 0.61: IC18.18 168.91,24.77 169.86,25.72 169.86,29.84 170.18,30.16 170.18,49.53 174.62,53.98 R84.1
IN2
  Bottom 0.61: IC18.17 168.91,22.23 170.81,24.13 170.81,29.53 171.45,30.16 171.45,48.89 172.72,50.17 R87.1
IN3  (via drill 0.6 pad 1.27)
  Top 0.61: v168.91,41.91 173.04,41.91 174.62,43.5 R90.1
  Bottom 0.61: v168.91,41.91 168.91,30.48 168.59,30.16 168.59,28.26 166.37,26.03 166.37,20.32 167,19.69 IC18.16
IN4  (via drill 0.6 pad 1.27)
  Top 0.61: v167.32,40.01 R93.1
  Bottom 0.61: IC18.15 167,17.14 165.42,18.73 165.42,26.67 167.32,28.58 v167.32,40.01
IN5
  Bottom 0.61: IC18.14 169.86,14.61 170.81,15.56 170.81,21.91 171.77,22.86 171.77,28.89 172.72,29.84 172.72,33.97 173.67,34.92 R96.1
IN6
  Bottom 0.61: IC18.13 170.81,12.07 171.77,13.02 171.77,21.27 172.72,22.23 172.72,27.94 R99.1
IN7
  Bottom 0.61: IC18.12 171.13,9.53 172.72,11.11 172.72,20.95 174.62,22.86 R102.1
IN8
  Bottom 0.61: IC18.11 173.67,6.98 174.62,7.94 R105.1
N$1
  Bottom 1.27: IC9.19 IC1.1
N$2
  Bottom 1.27: IC9.18 IC1.2
N$3
  Bottom 1.27: IC9.17 IC1.3
N$4
  Bottom 1.27: IC9.16 IC1.4
N$5
  Bottom 1.27: IC9.15 IC1.5
N$6
  Bottom 1.27: IC9.14 IC1.6
N$7
  Bottom 1.27: IC9.13 IC1.7
N$8
  Bottom 1.27: IC9.12 IC1.8
N$9
  Bottom 1.27: IC10.19 IC2.1
N$10
  Bottom 1.27: IC10.18 IC2.2
N$11
  Bottom 1.27: IC10.17 IC2.3
N$12
  Bottom 1.27: IC10.16 IC2.4
N$13
  Bottom 1.27: IC10.15 IC2.5
N$14
  Bottom 1.27: IC10.14 IC2.6
N$15
  Bottom 1.27: IC10.13 IC2.7
N$16
  Bottom 1.27: IC10.12 IC2.8
N$17
  Bottom 1.27: IC11.19 IC3.1
N$18
  Bottom 1.27: IC11.18 IC3.2
N$19
  Bottom 1.27: IC11.17 IC3.3
N$20
  Bottom 1.27: IC11.16 IC3.4
N$21
  Bottom 1.27: IC11.15 IC3.5
N$22
  Bottom 1.27: IC11.14 IC3.6
N$23
  Bottom 1.27: IC11.13 IC3.7
N$24
  Bottom 1.27: IC11.12 IC3.8
N$25
  Bottom 1.27: IC12.19 IC4.1
N$26
  Bottom 1.27: IC12.18 IC4.2
N$27
  Bottom 1.27: IC12.17 IC4.3
N$28
  Bottom 1.27: IC12.16 IC4.4
N$29
  Bottom 1.27: IC12.15 IC4.5
N$30
  Bottom 1.27: IC12.14 IC4.6
N$31
  Bottom 1.27: IC12.13 IC4.7
N$32
  Bottom 1.27: IC12.12 IC4.8
N$33
  Bottom 0.61: IC17.16 137.48,38.1 136.84,38.73 LSP4.MP
N$34
  Bottom 1.27: SV7.8 R49.2
N$35
  Bottom 1.27: SV7.7 R50.2
N$36
  Bottom 1.27: SV7.6 R51.2
N$37
  Bottom 1.27: SV7.5 R52.2
N$38
  Bottom 1.27: SV7.4 R53.2
N$39
  Bottom 1.27: SV7.3 R54.2
N$40
  Bottom 1.27: SV7.2 R55.2
N$41
  Bottom 1.27: SV7.1 R56.2
N$42
  Bottom 1.27: IC2.18 40.64,87.31 39.37,88.58 R9.1
N$43
  Bottom 1.27: IC1.18 11.43,87.31 12.7,88.58 R1.1
N$44
  Bottom 1.27: SV6.8 R41.2
N$45
  Bottom 1.27: IC5.1 IC13.19
N$46
  Bottom 1.27: IC5.2 IC13.18
N$47
  Bottom 1.27: IC5.3 IC13.17
N$48
  Bottom 1.27: IC1.17 13.97,87.31 15.24,88.58 R2.1
N$49
  Bottom 1.27: IC1.16 16.51,87.31 17.78,88.58 R3.1
N$50
  Bottom 1.27: IC1.15 19.05,87.31 20.32,88.58 R4.1
N$51
  Bottom 1.27: IC1.14 21.59,87.31 22.86,88.58 R5.1
N$52
  Bottom 1.27: IC1.13 24.13,87.31 25.4,88.58 R6.1
N$53
  Bottom 1.27: IC1.12 26.67,87.31 27.94,88.58 R7.1
N$54
  Bottom 1.27: IC1.11 29.21,87.31 30.48,88.58 R8.1
N$55
  Bottom 1.27: IC4.11 116.84,87.31 115.57,88.58 R32.1
N$56
  Bottom 1.27: IC4.12 114.3,87.31 113.03,88.58 R31.1
N$57
  Bottom 1.27: IC4.13 111.76,87.31 110.49,88.58 R30.1
N$58
  Bottom 1.27: IC4.14 109.22,87.31 107.95,88.58 R29.1
N$59
  Bottom 1.27: IC4.15 106.68,87.31 105.41,88.58 R28.1
N$60
  Bottom 1.27: IC4.16 104.14,87.31 102.87,88.58 R27.1
N$61
  Bottom 1.27: IC4.17 101.6,87.31 100.33,88.58 R26.1
N$62
  Bottom 1.27: IC4.18 99.06,87.31 97.79,88.58 R25.1
N$63
  Bottom 1.27: R1.2 SV1.1
N$64
  Bottom 1.27: IC5.4 IC13.16
N$65
  Bottom 1.27: IC2.17 43.18,87.31 41.91,88.58 R10.1
N$66
  Bottom 1.27: IC5.5 IC13.15
N$67
  Bottom 1.27: IC2.16 45.72,87.31 44.45,88.58 R11.1
N$68
  Bottom 1.27: IC5.6 IC13.14
N$69
  Bottom 1.27: IC5.7 IC13.13
N$70
  Bottom 1.27: IC2.15 48.26,87.31 46.99,88.58 R12.1
N$71
  Bottom 1.27: IC5.8 IC13.12
N$72
  Bottom 1.27: IC6.1 IC14.19
N$73
  Bottom 1.27: IC6.2 IC14.18
N$74
  Bottom 1.27: IC6.3 IC14.17
N$75
  Bottom 1.27: IC2.14 50.8,87.31 49.53,88.58 R13.1
N$76
  Bottom 1.27: IC2.13 53.34,87.31 52.07,88.58 R14.1
N$77
  Bottom 1.27: IC2.12 55.88,87.31 54.61,88.58 R15.1
N$78
  Bottom 1.27: IC2.11 58.42,87.31 57.15,88.58 R16.1
N$79
  Bottom 1.27: IC3.18 69.85,87.31 71.12,88.58 R17.1
N$80
  Bottom 1.27: IC3.17 72.39,87.31 73.66,88.58 R18.1
N$81
  Bottom 1.27: IC3.16 74.93,87.31 76.2,88.58 R19.1
N$82
  Bottom 1.27: IC3.15 77.47,87.31 78.74,88.58 R20.1
N$83
  Bottom 1.27: IC3.14 80.01,87.31 81.28,88.58 R21.1
N$84
  Bottom 1.27: IC3.13 82.55,87.31 83.82,88.58 R22.1
N$85
  Bottom 1.27: IC3.12 85.09,87.31 86.36,88.58 R23.1
N$86
  Bottom 1.27: IC6.4 IC14.16
N$87
  Bottom 1.27: IC6.5 IC14.15
N$88
  Bottom 1.27: IC3.11 87.63,87.31 88.9,88.58 R24.1
N$89
  Bottom 1.27: IC6.6 IC14.14
N$90
  Bottom 1.27: IC6.7 IC14.13
N$91
  Bottom 1.27: IC6.8 IC14.12
N$92
  Bottom 1.27: IC7.1 IC15.19
N$93
  Bottom 1.27: IC7.2 IC15.18
N$94
  Bottom 1.27: IC7.3 IC15.17
N$95
  Bottom 1.27: IC7.4 IC15.16
N$96
  Bottom 1.27: IC7.5 IC15.15
N$97
  Bottom 1.27: IC7.6 IC15.14
N$98
  Bottom 1.27: IC7.7 IC15.13
N$99
  Bottom 1.27: IC7.8 IC15.12
N$100
  Bottom 1.27: IC8.1 IC16.19
N$101
  Bottom 1.27: IC8.2 IC16.18
N$102
  Bottom 1.27: IC8.3 IC16.17
N$103
  Bottom 1.27: IC8.4 IC16.16
N$104
  Bottom 1.27: IC8.5 IC16.15
N$105
  Bottom 1.27: IC8.6 IC16.14
N$106
  Bottom 1.27: IC8.7 IC16.13
N$107
  Bottom 0.61: C1.2 137.16,49.53 138.43,48.26 IC17.12 141.6,48.26 144.65,51.31 Q1.2
N$108
  Bottom 1.27: IC8.8 IC16.12
N$109
  Bottom 1.27: SV6.7 R42.2
N$110
  Bottom 1.27: SV6.6 R43.2
N$111
  Bottom 1.27: SV6.5 R44.2
N$112
  Bottom 1.27: SV6.4 R45.2
N$113
  Bottom 1.27: SV6.3 R46.2
N$114
  Bottom 1.27: SV6.2 R47.2
N$115
  Bottom 1.27: SV6.1 R48.2
N$116
  Bottom 1.676: R83.1 177.16,56.52 R84.2 Q2.B
N$117
  Bottom 1.27: IC5.18 116.84,13.02 115.57,11.75 R33.1
N$118
  Bottom 1.27: IC5.17 114.3,13.02 113.03,11.75 R34.1
N$119
  Bottom 1.27: IC5.16 111.76,13.02 110.49,11.75 R35.1
N$120
  Bottom 1.27: IC5.15 109.22,13.02 107.95,11.75 R36.1
N$121
  Bottom 1.27: IC5.14 106.68,13.02 105.41,11.75 R37.1
N$122
  Bottom 1.27: R2.2 SV1.2
N$123
  Bottom 1.27: R3.2 SV1.3
N$124
  Bottom 1.27: R4.2 SV1.4
N$125
  Bottom 1.27: R5.2 SV1.5
N$126
  Bottom 1.27: R6.2 SV1.6
N$127
  Bottom 1.27: R7.2 SV1.7
N$128
  Bottom 1.27: R8.2 SV1.8
N$129
  Bottom 1.27: R9.2 SV2.1
N$130
  Bottom 1.27: IC5.13 104.14,13.02 102.87,11.75 R38.1
N$131
  Bottom 1.27: IC5.12 101.6,13.02 100.33,11.75 R39.1
N$132
  Bottom 1.27: IC5.11 99.06,13.02 97.79,11.75 R40.1
N$133
  Bottom 1.27: IC8.11 11.43,13.02 12.7,11.75 R64.1
N$134
  Bottom 1.27: IC8.12 13.97,13.02 15.24,11.75 R63.1
N$135
  Bottom 1.27: IC8.13 16.51,13.02 17.78,11.75 R62.1
N$136
  Bottom 1.27: IC8.14 19.05,13.02 20.32,11.75 R61.1
N$137
  Bottom 1.27: IC8.15 21.59,13.02 22.86,11.75 R60.1
N$138
  Bottom 1.27: IC8.16 24.13,13.02 25.4,11.75 R59.1
N$139
  Bottom 1.27: IC8.17 26.67,13.02 27.94,11.75 R58.1
N$140
  Bottom 1.27: IC8.18 29.21,13.02 30.48,11.75 R57.1
N$141
  Bottom 1.27: IC6.18 87.63,13.02 88.9,11.75 R41.1
N$142
  Bottom 1.27: IC6.17 85.09,13.02 86.36,11.75 R42.1
N$143
  Bottom 1.27: IC6.16 82.55,13.02 83.82,11.75 R43.1
N$144
  Bottom 1.27: IC6.15 80.01,13.02 81.28,11.75 R44.1
N$145
  Bottom 1.27: IC6.14 77.47,13.02 78.74,11.43 R45.1
N$146
  Bottom 1.27: IC6.13 74.93,13.02 76.2,11.43 R46.1
N$147
  Bottom 1.27: IC6.12 72.39,13.02 73.66,11.75 R47.1
N$148
  Bottom 1.27: IC6.11 69.85,13.02 71.12,11.75 R48.1
N$149
  Bottom 1.27: IC7.18 58.42,12.7 57.15,11.43 R49.1
N$150
  Bottom 1.27: R10.2 SV2.2
N$151
  Bottom 1.27: IC7.17 55.88,13.02 54.61,11.75 R50.1
N$152
  Bottom 1.27: IC7.16 53.34,13.02 52.07,11.75 R51.1
N$153
  Bottom 1.27: IC7.15 50.8,13.02 49.53,11.75 R52.1
N$154
  Bottom 1.27: IC7.14 48.26,13.02 46.99,11.75 R53.1
N$155
  Bottom 1.27: IC7.13 45.72,13.02 44.45,11.75 R54.1
N$156
  Bottom 1.27: IC7.12 43.18,13.02 41.91,11.75 R55.1
N$157
  Bottom 1.27: IC7.11 40.64,13.02 39.37,11.75 R56.1
N$158
  Bottom 1.27: SV5.8 R33.2
N$159
  Bottom 1.27: SV5.7 R34.2
N$160
  Bottom 1.27: SV5.6 R35.2
N$161
  Bottom 1.27: SV5.5 R36.2
N$162
  Bottom 1.27: SV5.4 R37.2
N$163
  Bottom 1.27: SV5.3 R38.2
N$164
  Bottom 1.27: SV5.2 R39.2
N$165
  Bottom 1.27: SV5.1 R40.2
N$166
  Bottom 1.27: SV8.8 R57.2
N$167
  Bottom 1.27: R11.2 SV2.3
N$168
  Bottom 1.27: R12.2 SV2.4
N$169
  Bottom 1.27: R13.2 SV2.5
N$170
  Bottom 1.27: R14.2 SV2.6
N$171
  Bottom 1.27: R15.2 SV2.7
N$172
  Bottom 1.27: R16.2 SV2.8
N$173
  Bottom 1.27: R17.2 SV3.1
N$174
  Bottom 1.27: R18.2 SV3.2
N$175
  Bottom 1.27: R19.2 SV3.3
N$176
  Bottom 1.27: R20.2 SV3.4
N$177
  Bottom 1.27: R21.2 SV3.5
N$178
  Bottom 1.27: R22.2 SV3.6
N$179
  Bottom 1.27: R23.2 SV3.7
N$180
  Bottom 1.27: R24.2 SV3.8
N$181
  Bottom 1.27: R25.2 SV4.1
N$182
  Bottom 1.27: R26.2 SV4.2
N$183
  Bottom 1.27: R27.2 SV4.3
N$184
  Bottom 1.27: R28.2 SV4.4
N$185
  Bottom 1.27: SV4.5 R29.2
N$186
  Bottom 1.27: SV4.6 R30.2
N$187
  Bottom 1.27: R31.2 SV4.7
N$188
  Bottom 1.27: R32.2 SV4.8
N$189
  Bottom 1.27: SV8.7 R58.2
N$190
  Bottom 1.27: SV8.6 R59.2
N$191
  Bottom 1.27: SV8.5 R60.2
N$192
  Bottom 1.27: SV8.4 R61.2
N$193
  Bottom 1.27: SV8.3 R62.2
N$194
  Bottom 1.27: SV8.2 R63.2
N$195
  Bottom 1.27: SV8.1 R64.2
N$196
  Bottom 0.61: C30.D- 193.74,74.61 194.31,74.61 194.94,75.25 194.94,77.15 193.36,78.74 192.09,78.74 189.87,76.52 180.97,76.52 179.71,75.25 U2.12
N$197
  Bottom 0.61: C30.D+ 182.88,75.56 182.25,75.25 U2.13
N$198
  Bottom 0.813: C26.1 177.16,71.76 U2.11
N$199
  Bottom 0.813: R76.1 C28.2 C30.P$6 C30.P$7
N$200
  Bottom 0.813: LED1.A R77.1
N$201
  Bottom 1.676: R86.1 177.16,51.44 R87.2 Q3.B
N$202
  Bottom 1.016: R78.2 LED2.K
N$203
  Bottom 0.61: C2.2 137.16,46.99 138.43,45.72 IC17.13 141.6,45.72 142.37,46.48 Q1.1
N$204
  Bottom 0.61: IC17.30 R67.1
  Bottom 0.813: IC17.30 156.53,50.8 158.75,53.02 C5.+
N$205
  Bottom 0.813: IC17.32 C6.+
N$206
  Bottom 1.016: R79.2 LED3.K
N$207
  Bottom 1.016: R80.2 LED4.K
N$208
  Bottom 1.676: R89.1 177.16,46.36 R90.2 Q4.B
N$209
  Bottom 1.676: R92.1 177.16,41.28 R93.2 Q5.B
N$210
  Bottom 1.676: R95.1 177.16,36.2 R96.2 Q6.B
N$211
  Bottom 1.676: R98.1 177.16,31.12 R99.2 Q7.B
N$212
  Bottom 1.676: R101.1 177.16,26.03 R102.2 Q8.B
N$213
  Bottom 1.676: R104.1 177.16,20.95 R105.2 Q9.B
N$214
  Bottom 0.61: V1.15 155.57,19.69 158.75,22.86 158.75,24.45 159.07,24.77 IC18.1
N$216
  Bottom 0.61: IC17.29 R68.2
N$217
  Bottom 0.61: R69.2 IC17.28
N$218
  Bottom 0.61: IC17.27 R70.2
N$219
  Bottom 0.61: IC17.26 R71.2
N$220
  Bottom 0.61: IC17.25 R72.2
N$221
  Bottom 0.61: IC17.24 R73.2
N$222
  Bottom 0.61: IC17.23 R74.2
N$223
  Bottom 0.61: IC17.22 R75.2
N$224
  Bottom 0.61: V1.14 155.89,17.14 157.48,18.73 157.48,19.05 159.07,20.64 159.07,21.59 159.7,22.23 IC18.2
N$225
  Bottom 0.61: V1.13 155.89,14.61 158.43,17.14 158.43,18.42 159.7,19.69 IC18.3
N$226
  Bottom 0.61: V1.12 155.89,12.07 157.8,13.97 157.8,14.92 160.02,17.14 IC18.4
N$227
  Bottom 0.61: V1.11 155.89,9.53 158.75,12.38 158.75,14.29 159.07,14.61 IC18.5
N$228
  Bottom 0.61: V1.10 156.21,6.98 158.43,9.21 158.43,10.48 160.02,12.07 IC18.6
N$229
  Bottom 0.61: V1.9 154.62,4.13 156.84,4.13 158.43,5.72 162.56,5.72 163.19,6.35 163.19,8.89 162.56,9.53 IC18.7
N$230
  Bottom 0.61: V1.7 148.59,6.98 149.86,5.72 156.84,5.72 158.12,6.98 IC18.8
N$231
  Bottom 1.676: IC17.40 SV11.1
N$232
  Bottom 1.676: IC17.39 SV11.2
N$233
  Bottom 1.676: IC17.38 SV11.3
N$234
  Bottom 1.676: IC17.37 SV11.4
N$235
  Bottom 1.676: IC17.36 SV11.5
N$236
  Bottom 1.676: IC17.35 SV11.6
N$237
  Bottom 1.676: IC17.34 SV11.7
N$238
  Bottom 1.676: IC17.33 SV11.8
OUT1
  Bottom 1.27: 182.25,56.52 183.51,57.78 185.42,57.78 188.24,54.97 X3.2
  Bottom 1.422: Q2.C 182.25,56.52
OUT2
  Bottom 1.27: Q3.C 182.25,51.44 183.51,52.7 185.42,52.7 188.16,49.96 X3.3
OUT3
  Bottom 1.27: Q4.C 182.25,46.36 183.51,47.62 185.42,47.62 188.09,44.96 X3.4
OUT4
  Bottom 1.27: Q5.C 182.25,41.28 183.51,42.55 185.42,42.55 188.01,39.95 X3.5
OUT5
  Bottom 1.27: Q6.C 182.25,36.2 183.51,37.47 185.42,37.47 187.91,34.98 X3.6
OUT6
  Bottom 1.27: Q7.C 182.25,31.12 183.51,32.39 185.42,32.39 187.83,29.97 X3.7
OUT7
  Bottom 1.27: Q8.C 182.25,26.03 183.51,27.31 185.42,27.31 187.76,24.97 X3.8
OUT8
  Bottom 1.27: Q9.C 182.25,20.95 183.51,22.23 185.42,22.23 187.68,19.96 X3.9
RESET  (via drill 0.6 pad 1.27)
  Top 0.61: C3.2 132.72,76.84 v132.72,55.88
  Bottom 0.61: v132.72,55.88 IC17.9
  Bottom 0.813: C3.2 138.11,78.74 140.97,81.6 R66.1 135.89,86.36 135.29,86.96 S1.2 S1.1 136.13,95.33 136.84,94.61 SV10.5
SCL
  Bottom 0.813: R81.1 174.62,71.12 U2.10
SDA
  Bottom 0.813: R82.1 172.09,70.48 U2.9
URX  (via drill 0.6 pad 1.27)
  Top 0.406: v162.56,41.91 152.4,41.91
  Top 0.61: IC17.15 151.13,40.64 152.4,41.91
  Bottom 0.61: v162.56,41.91 163.83,41.91 167.64,45.72 167.64,50.8 171.45,54.93 171.45,66.36 170.81,66.99 170.81,74.3 174.62,78.11 U2.5
UTX  (via drill 0.6 pad 1.27)
  Top 0.406: v162.56,44.45 152.4,44.45
  Top 0.61: IC17.14 151.13,43.18 152.4,44.45
  Bottom 0.61: v162.56,44.45 163.83,44.45 166.37,46.99 166.37,51.44 170.18,55.25 170.18,65.41 168.28,67.31 168.28,74.3 172.09,78.11 U2.6
VBUS
  Top 1.016: C29.2 187.96,73.03 187.01,73.98 187.01,79.06 186.06,80.01 U2.1
  Bottom 0.813: R82.2 R81.2 188.59,66.67 189.55,67.63 C29.2 | 166.37,77.15 R77.2
  Bottom 1.016: C30.VBUS 191.44,73.03 C29.2 | C25.+ 166.37,83.12 | 186.69,88.58 184.78,86.68 C27.1 | D1.A 166.37,77.15
  Bottom 1.27: U2.1 C27.1 | 186.69,88.58 186.69,96.52 186.06,97.16 LED2.A LED3.A LED4.A 173.67,97.16 172.09,95.57 172.09,86.99 171.39,86.3 C25.+ | 166.37,83.12 D1.A

## Text on the board
Top: BBS TGHS | LED-Cube | Rev.2
Document: Zeile 0 | Zeile 1 | Zeile 2 | Zeile 3 | D0 | D7 | D0 | D7 | D7 | D7 | GND | D0 | D0 | +5V | +5V | Betrieb | D0 | D7 | D0 | D7 | D0 | D7 | D0 | D7 | +12V | Layer 0 | Layer 1 | CL7 | CL6 | Layer 2 | CL5 | CL4 | Layer 3 | CL3 | D0 | D7 | D0 | D7 | D0 | D7 | D0 | D7 | PD2 | CL2 | Layer 4 | CL1 | CL0 | Layer 5 | GND | Layer 6 | Layer 7 | +12V | GNDA | D7 | D7 | D0 | D7 | D7 | D0 | D0 | D0 | Zeile 6 | Zeile 5 | Zeile 4 | GNDA | +12V | Zeile 7